# EAGLE design rev02 (EAGLE 6.5.0)
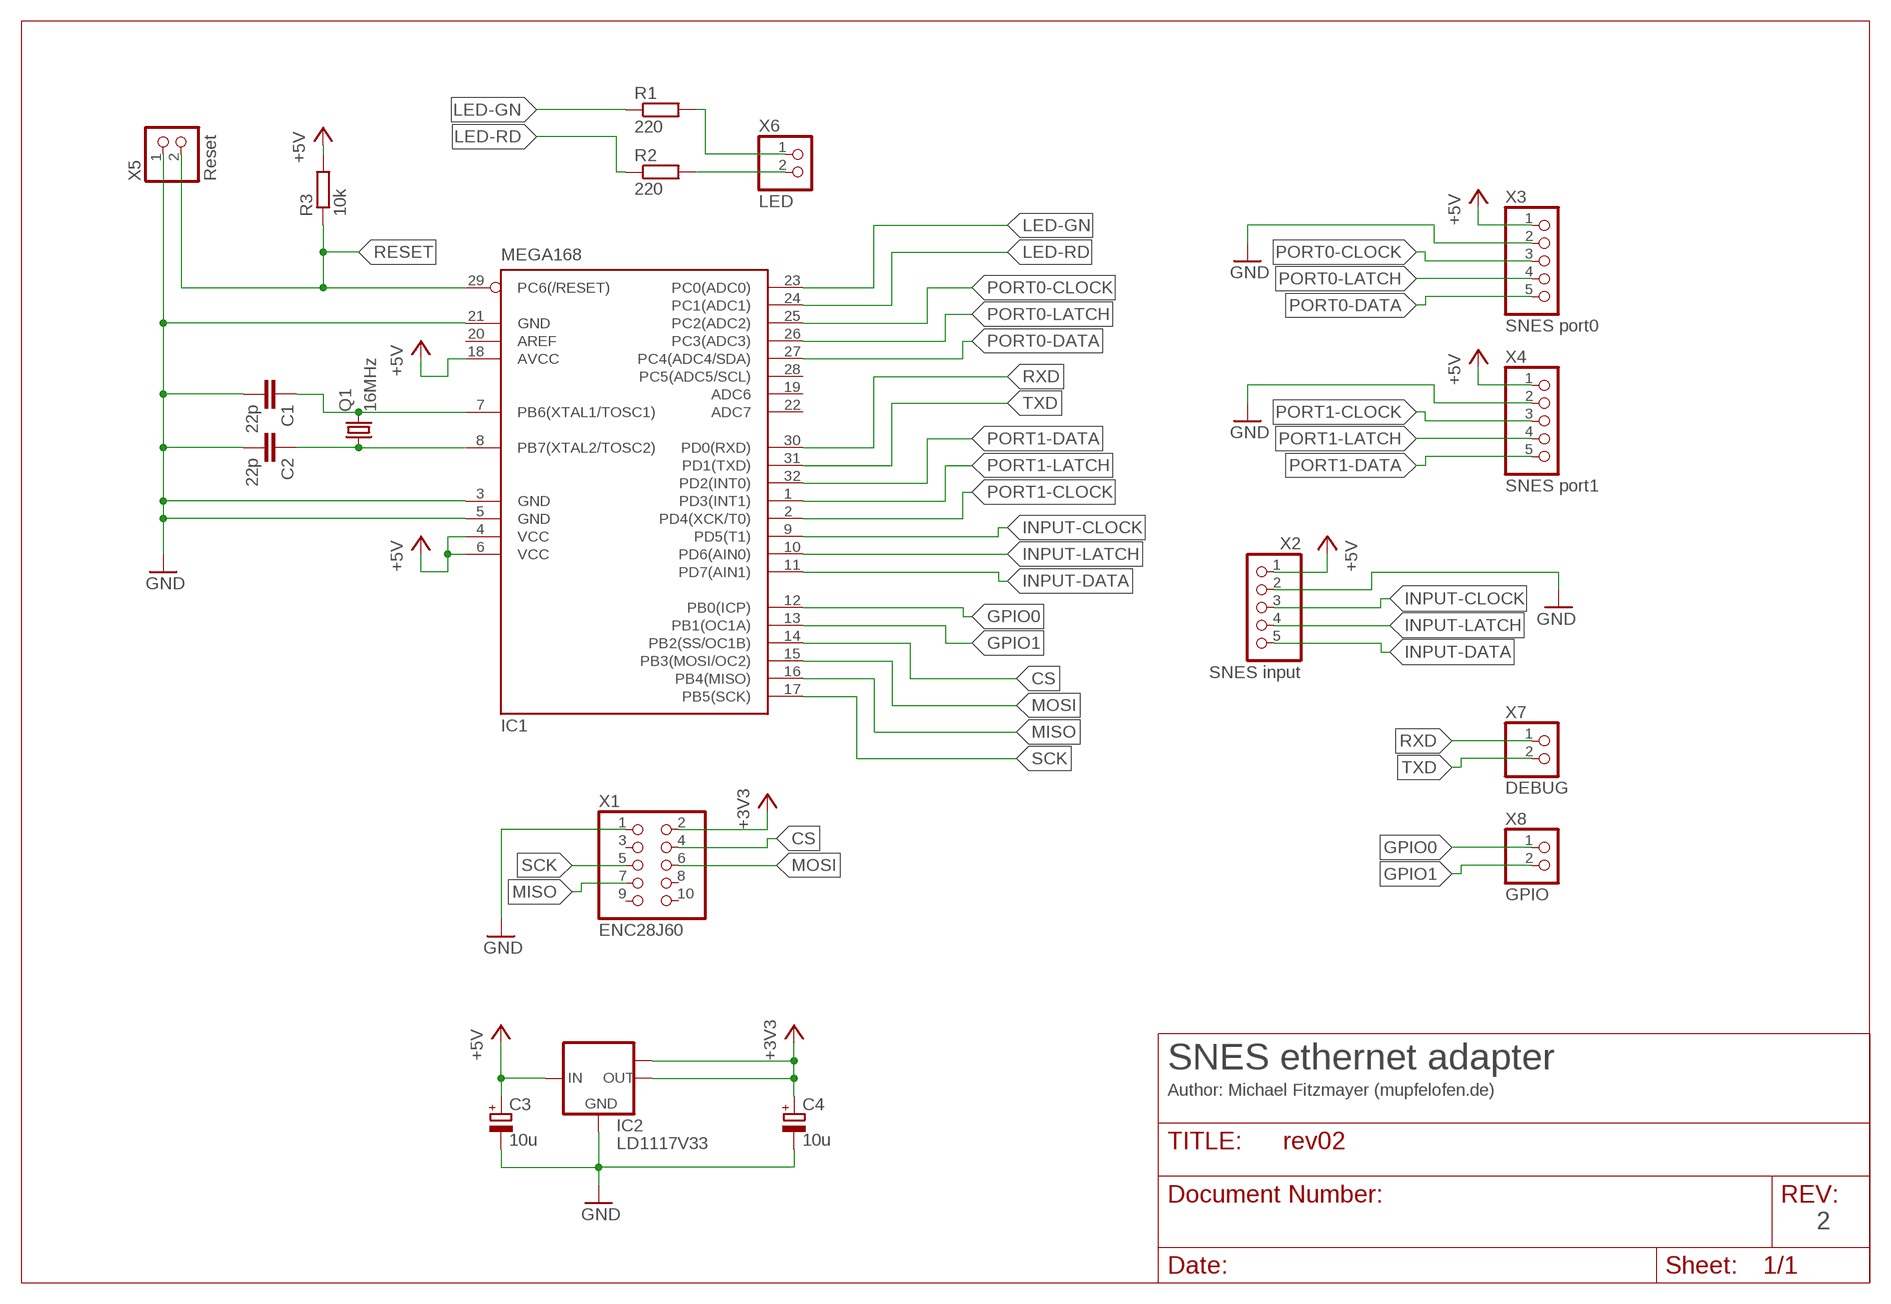
[diagram p0: schematic, sheet 1]

## Parts
C1  22p  C-EUC1206  [C1206]
C2  22p  C-EUC1206  [C1206]
C3  10u  CPOL-EUC/6032-28R  [C/6032-28R]
C4  10u  CPOL-EUC/6032-28R  [C/6032-28R]
IC1  MEGA168  MEGA8-AI  [TQFP32-08]
IC2  LD1117V33  LM1117MPX-3.3  [SOT223]
Q1  16MHz  CRYSTALSM49  [SM49]
R1  220  R-EU_R1206  [R1206]
R2  220  R-EU_R1206  [R1206]
R3  10k  R-EU_R1206  [R1206]
X1  ENC28J60  PINHD-2X5_2.54-SMD  [2X05SMD]
X2  SNES input  PINHD-1X5_2.54-SMD  [1X05SMD]
X3  SNES port0  PINHD-1X5_2.54-SMD  [1X05SMD]
X4  SNES port1  PINHD-1X5_2.54-SMD  [1X05SMD]
X5  Reset  PINHD-1X2_2.54-SMD  [1X02SMD]
X6  LED  PINHD-1X2_2.54-SMD  [1X02SMD]
X7  DEBUG  PINHD-1X2_2.54-SMD  [1X02SMD]
X8  GPIO  PINHD-1X2_2.54-SMD  [1X02SMD]

## Nets
+3V3: C4.+ IC2.2(OUT) IC2.TAB(OUT1) X1.2
+5V: C3.+ IC1.4(VCC) IC1.6(VCC) IC1.18(AVCC) IC2.3(IN) R3.2 X2.1 X3.1 X4.1
CS: IC1.14(PB2(SS/OC1B)) X1.4
GND: C1.2 C2.2 C3.- C4.- IC1.3(GND) IC1.5(GND) IC1.21(GND) IC2.1(GND) X1.1 X2.2 X3.2 X4.2 X5.1
GPIO0: IC1.12(PB0(ICP)) X8.1
GPIO1: IC1.13(PB1(OC1A)) X8.2
INPUT-CLOCK: IC1.9(PD5(T1)) X2.3
INPUT-DATA: IC1.11(PD7(AIN1)) X2.5
INPUT-LATCH: IC1.10(PD6(AIN0)) X2.4
LED-GN: IC1.23(PC0(ADC0)) R1.1
LED-RD: IC1.24(PC1(ADC1)) R2.1
MISO: IC1.16(PB4(MISO)) X1.7
MOSI: IC1.15(PB3(MOSI/OC2)) X1.6
N$1: R2.2 X6.2
N$2: R1.2 X6.1
N$4: C1.1 IC1.7(PB6(XTAL1/TOSC1)) Q1.2
N$5: C2.1 IC1.8(PB7(XTAL2/TOSC2)) Q1.1
PORT0-CLOCK: IC1.25(PC2(ADC2)) X3.3
PORT0-DATA: IC1.27(PC4(ADC4/SDA)) X3.5
PORT0-LATCH: IC1.26(PC3(ADC3)) X3.4
PORT1-CLOCK: IC1.2(PD4(XCK/T0)) X4.3
PORT1-DATA: IC1.32(PD2(INT0)) X4.5
PORT1-LATCH: IC1.1(PD3(INT1)) X4.4
RESET: IC1.29(PC6(/RESET)) R3.1 X5.2
RXD: IC1.30(PD0(RXD)) X7.1
SCK: IC1.17(PB5(SCK)) X1.5
TXD: IC1.31(PD1(TXD)) X7.2
Unconnected: IC1.19(ADC6) IC1.20(AREF) IC1.22(ADC7) IC1.28(PC5(ADC5/SCL)) X1.3 X1.8 X1.9 X1.10

## Notes on the sheet
- SNES ethernet adapter
- Author: Michael Fitzmayer (mupfelofen.de)
- 2

## Library data of the parts
C1 C2 = resistor:C-EU: CAPACITOR, European symbol
C3 C4 = resistor:CPOL-EU: POLARIZED CAPACITOR, European symbol
IC1 = atmel:MEGA8: MICROCONTROLLER 8 Kbytes FLASH, 1 kbytes SRAM, 512 bytes EEPROM, USART, 6-channel 10 bit ADC, 2-channel 8 bit ADC Pin compatible with Atmega48, ATMega88, ATMega168 Source: avr.lbr; MPN: ATMEGA8-16AU; OC_FARNELL: 9171371; OC_NEWARK: 73M8863
IC2 = lm1117:LM1117MPX-*
Q1 = crystal:CRYSTAL: CRYSTAL; OC_FARNELL: unknown; OC_NEWARK: unknown
R1-R3 = resistor:R-EU_: RESISTOR, European symbol
X1 = pinhead:PINHD-2X5: PIN HEADER
X2-X4 = pinhead:PINHD-1X5: PIN HEADER
X5-X8 = pinhead:PINHD-1X2: PIN HEADER

## Board
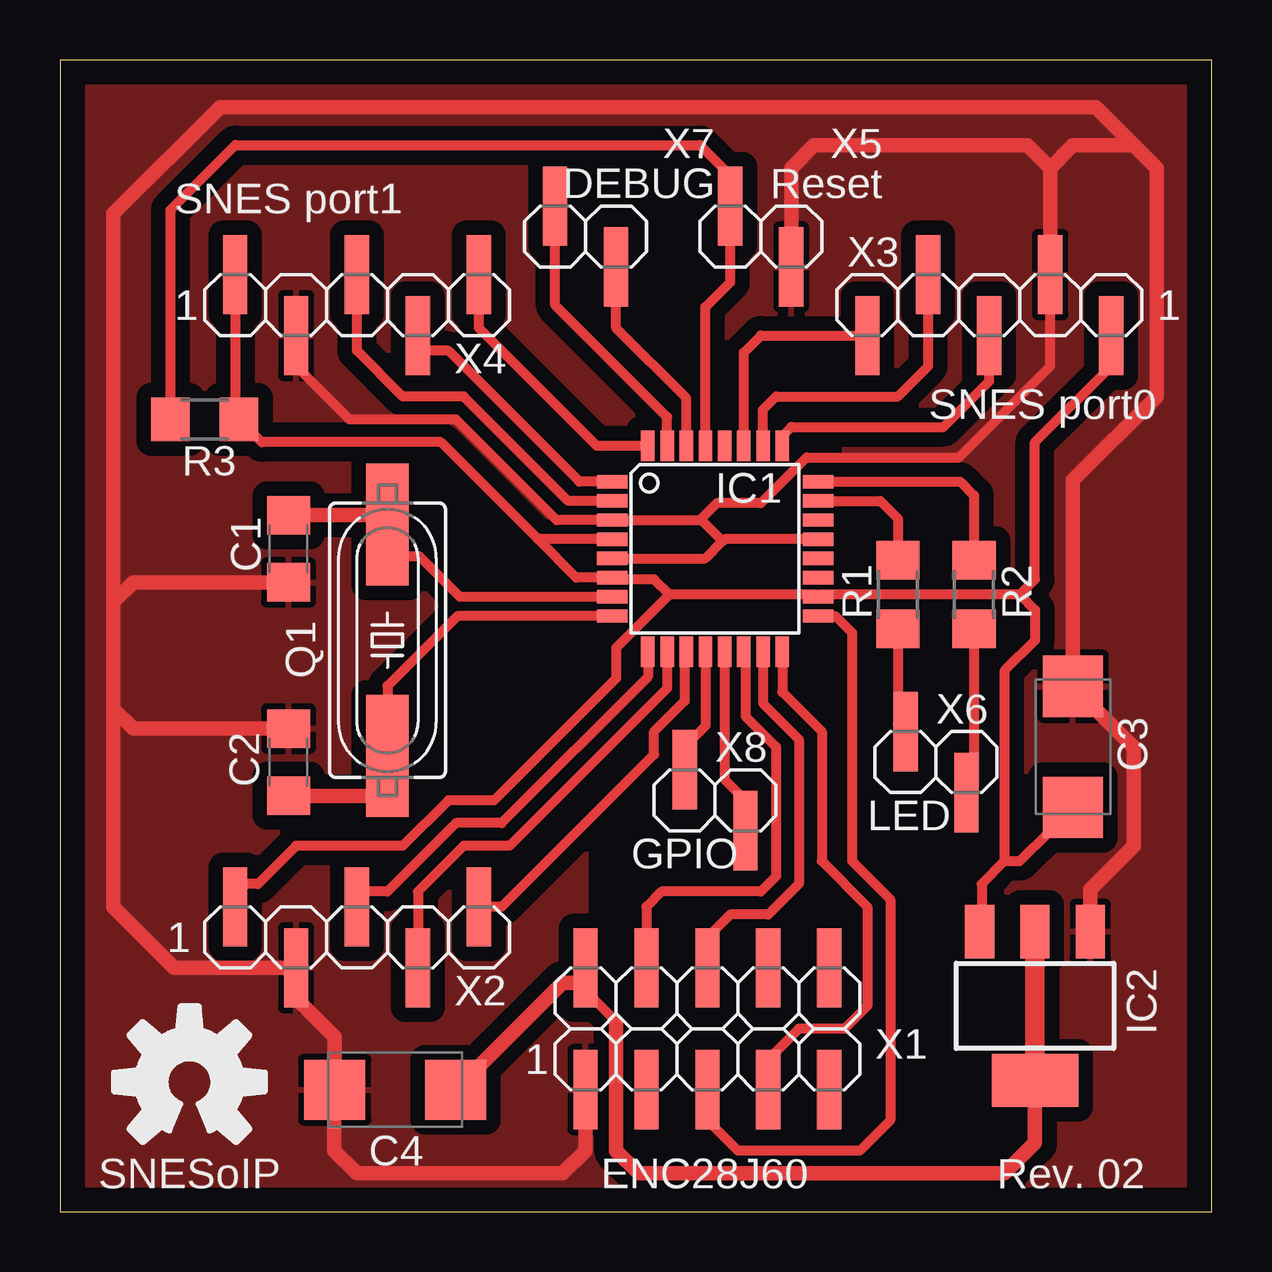
[diagram p1: board, top side]

Size 48 x 48 mm. Coordinates in mm from the lower left corner, seen from the top.
Outline: 0,0 48,0 48,48 0,48 0,0
Copper layers (1*16): Top 0.035mm / dielectric 1.5mm / Bottom 0.035mm
Design rules "default": minimum track width 10mil, minimum drill 24mil, track to track 8mil, track to pad 8mil, pad to pad 8mil, via to via 8mil, smd to smd 8mil, copper to edge 40mil, drill to drill 8mil, minimum pad ring 10mil, minimum via ring 8mil, stop-mask expansion 4mil, vias tented up to drill 0mil, thermal gap 10mil

### Footprints (pad centres in the part's own frame; a part is rotated, then mirrored left to right if it is on the bottom)
C1206 = smd 1.6 x 1.8: 1 -1.4,0; 2 1.4,0
C/6032-28R = smd 2.55 x 2.5: + 2.525,0; - -2.525,0
TQFP32-08 = smd 1.27 x 0.559: 1 -4.293,2.8; 2 -4.293,2; 3 -4.293,1.2; 4 -4.293,0.4; 5 -4.293,-0.4; 6 -4.293,-1.2; 7 -4.293,-2; 8 -4.293,-2.8; 17 4.293,-2.8; 18 4.293,-2; 19 4.293,-1.2; 20 4.293,-0.4; 21 4.293,0.4; 22 4.293,1.2; 23 4.293,2; 24 4.293,2.8 | smd 0.559 x 1.27: 9 -2.8,-4.293; 10 -2,-4.293; 11 -1.2,-4.293; 12 -0.4,-4.293; 13 0.4,-4.293; 14 1.2,-4.293; 15 2,-4.293; 16 2.8,-4.293; 25 2.8,4.293; 26 2,4.293; 27 1.2,4.293; 28 0.4,4.293; 29 -0.4,4.293; 30 -1.2,4.293; 31 -2,4.293; 32 -2.8,4.293
SOT223 = smd 1.219 x 2.235: 1 -2.311,-3.099; 2 0,-3.099; 3 2.311,-3.099 | smd 3.6 x 2.2: TAB 0,3.099
SM49 = smd 5.08 x 1.778: 1 -4.826,0; 2 4.826,0
R1206 = smd 1.6 x 1.803: 1 -1.422,0; 2 1.422,0
2X05SMD = smd 1.016 x 3.302: 1 -1.27,-3.81; 2 -1.27,1.27; 3 1.27,-3.81; 4 1.27,1.27; 5 3.81,-3.81; 6 3.81,1.27; 7 6.35,-3.81; 8 6.35,1.27; 9 8.89,-3.81; 10 8.89,1.27
1X05SMD = smd 1.016 x 3.302: 1 -1.27,1.27; 2 1.27,-1.27; 3 3.81,1.27; 4 6.35,-1.27; 5 8.89,1.27
1X02SMD = smd 1.016 x 3.302: 1 -1.27,1.27; 2 1.27,-1.27

### Placement (x,y rotation side)
C1  9.53,27.62 270 top
C2  9.53,18.73 90 top
C3  42.23,19.37 270 top
C4  13.97,5.08 0 top
IC1  27.3,27.62 0 top
IC2  40.64,8.57 180 top
Q1  13.65,23.81 90 top
R1  34.92,25.72 270 top
R2  38.1,25.72 270 top
R3  6.03,33.02 0 top
X1  23.18,8.89 0 top
X2  8.57,11.43 0 top
X3  42.55,37.78 180 top
X4  8.57,37.78 0 top
X5  29.21,40.64 180 top
X6  36.51,18.73 0 top
X7  21.91,40.64 180 top
X8  27.3,17.14 0 top

### Tracks (layer width: path | path; a pad name or v marks a point on that pad's centre or on a via)
+3V3
  Top 0.406: 23.18,7.94 21.91,9.21 21.91,9.53 X1.2 | 16.83,5.08 16.83,5.4
  Top 0.61: IC2.TAB 40.64,2.86 39.37,1.59 24.13,1.59 23.18,2.54 23.18,7.94 | C4.+ 16.83,5.08 | 16.83,5.4 20.95,9.53 21.91,9.53
  Top 0.813: IC2.2 IC2.TAB
+5V
  Top 0.406: 25.4,25.72 24.77,26.35 23.08,26.35 IC1.6 21.52,26.42 19.92,28.02 | 25.4,25.72 31.5,25.72 IC1.18 31.69,25.72 40.01,25.72 | IC1.4 19.92,28.02 | 19.92,28.02 15.88,32.07 8.41,32.07 R3.2 7.3,33.17 X4.1 | 40.01,25.72 40.64,26.35 40.64,32.07 43.81,35.24 X3.1 | 40.01,25.72 40.64,25.08 40.64,23.81 39.37,22.54 39.37,14.61 | 39.37,14.61 38.42,13.65 38.42,11.76 IC2.3 | 39.37,14.61 40.01,14.61 41.27,15.88 42.23,15.88 C3.+ | 25.4,25.72 23.18,23.5 23.18,22.23 18.1,17.14 16.19,17.14 14.29,15.24 9.84,15.24 8.26,13.65 7.3,13.65 X2.1
CS
  Top 0.406: IC1.14 28.57,23.26 28.57,20.64 29.84,19.37 29.84,13.97 29.21,13.34 25.08,13.34 24.45,12.7 X1.4
GND
  Top 0.406: IC1.5 26.91,27.22 27.62,27.94 | IC1.21 27.7,28.02 27.62,27.94 | 26.67,28.82 IC1.3 20.71,28.82 16.51,33.02 12.06,33.02 9.84,35.24 X4.2 | 26.67,28.82 26.74,28.82 27.62,27.94 | 26.67,28.82 27.38,29.53 29.21,29.53 31.11,31.43 37.47,31.43 41.27,35.24 X3.2 | 11.43,5.07 C4.-
  Top 0.61: X5.1 30.48,43.5 31.43,44.45 40.32,44.45 41.27,43.5 | 41.27,43.5 X3.2 | 44.77,44.45 45.72,43.5 45.72,33.97 42.23,30.48 C3.- 44.77,19.35 44.77,15.24 42.95,13.42 IC2.1 | 44.77,44.45 42.23,44.45 41.27,43.5 | X1.1 21.91,2.54 20.95,1.59 12.38,1.59 11.43,2.54 11.43,5.07 | 2.22,20.95 2.22,12.7 4.76,10.16 X2.2 9.84,8.89 11.45,7.29 C4.- | 2.22,20.95 2.22,25.4 | 2.22,25.4 2.22,41.59 6.67,46.04 43.18,46.04 44.77,44.45 | C2.2 3.04,20.13 2.22,20.95 | C1.2 3.04,26.22 2.22,25.4
  pour Top (isolate 0.61): -2,50 50,50 50,33.02 -2,32.7
  pour Top (isolate 0.61): 21.91,33.34 21.91,-2 -2,-2 -2,33.34
  pour Top (isolate 0.61): 32.7,33.34 32.7,-2 50,-2 50,33.34
  pour Top (isolate 0.61): 21.59,22.23 33.02,22.23 33.02,-2 21.59,-2
GPIO0
  Top 0.406: IC1.12 26.91,20.24 26.04,19.37 X8.1
GPIO1
  Top 0.406: IC1.13 27.7,18.02 28.57,17.14 X8.2
INPUT-CLOCK
  Top 0.406: 12.38,12.06 X2.3 12.38,13.34 13.65,13.34 16.51,16.19 18.41,16.19 24.5,22.28 IC1.9
INPUT-DATA
  Top 0.406: IC1.11 26.04,23.26 26.04,21.27 24.77,20 24.77,19.05 18.41,12.7 X2.5
INPUT-LATCH
  Top 0.406: IC1.10 25.3,21.81 18.73,15.24 16.83,15.24 14.92,13.34 X2.4
LED-GN
  Top 0.406: IC1.23 34.2,29.62 34.92,28.89 R1.1
LED-RD
  Top 0.406: IC1.24 37.52,30.42 38.1,29.84 R2.1
MISO
  Top 0.406: IC1.16 30.11,21.65 31.75,20 31.75,14.61 33.66,12.7 33.66,8.57 32.7,7.62 30.8,7.62 29.53,6.35 X1.7
MOSI
  Top 0.406: IC1.15 29.3,21.18 30.8,19.68 30.8,13.65 29.53,12.38 27.94,12.38 26.99,11.43 X1.6
N$1
  Top 0.406: R2.2 38.1,17.78 X6.2
N$2
  Top 0.406: R1.2 34.92,20.32 X6.1
N$4
  Top 0.406: IC1.7 16.67,25.62 14.99,27.3 13.65,27.3 Q1.2 13.27,29.02
  Top 0.61: C1.1 13.27,29.02
N$5
  Top 0.406: IC1.8 16.57,24.82 13.65,21.91 Q1.1 13.65,17.14 13.46,17.33
  Top 0.61: C2.1 13.46,17.33
PORT0-CLOCK
  Top 0.406: IC1.25 30.11,32.33 30.48,32.7 36.83,32.7 38.73,34.61 X3.3
PORT0-DATA
  Top 0.406: IC1.27 28.5,35.81 29.21,36.51 X3.5
PORT0-LATCH
  Top 0.406: IC1.26 29.3,33.43 29.84,33.97 34.92,33.97 36.2,35.24 X3.4
PORT1-CLOCK
  Top 0.406: IC1.2 21.18,29.62 16.83,33.97 14.29,33.97 12.38,35.88 X4.3
PORT1-DATA
  Top 0.406: 17.78,38.73 X4.5 17.46,36.83 22.38,31.91 IC1.32
PORT1-LATCH
  Top 0.406: IC1.1 21.65,30.42 16.19,35.88 14.92,35.88 X4.4
RESET
  Top 0.406: IC1.29 26.91,37.7 27.94,38.73 X5.2 27.94,43.18 26.67,44.45 7.3,44.45 4.61,41.76 R3.1
RXD
  Top 0.406: IC1.30 26.11,33.9 23.18,36.83 X7.1
SCK
  Top 0.406: IC1.17 32.33,24.82 33.02,24.13 33.02,14.61 34.61,13.02 34.61,3.81 33.34,2.54 28.26,2.54 26.99,3.81 X1.5
TXD
  Top 0.406: IC1.31 25.3,33.12 20.64,37.78 X7.2

### Text on the board
tPlace: 1 | 1 | 1 | 1 | SNESoIP | Rev. 02